# EAGLE design Flashing-light-v5 (EAGLE 7.6.0)
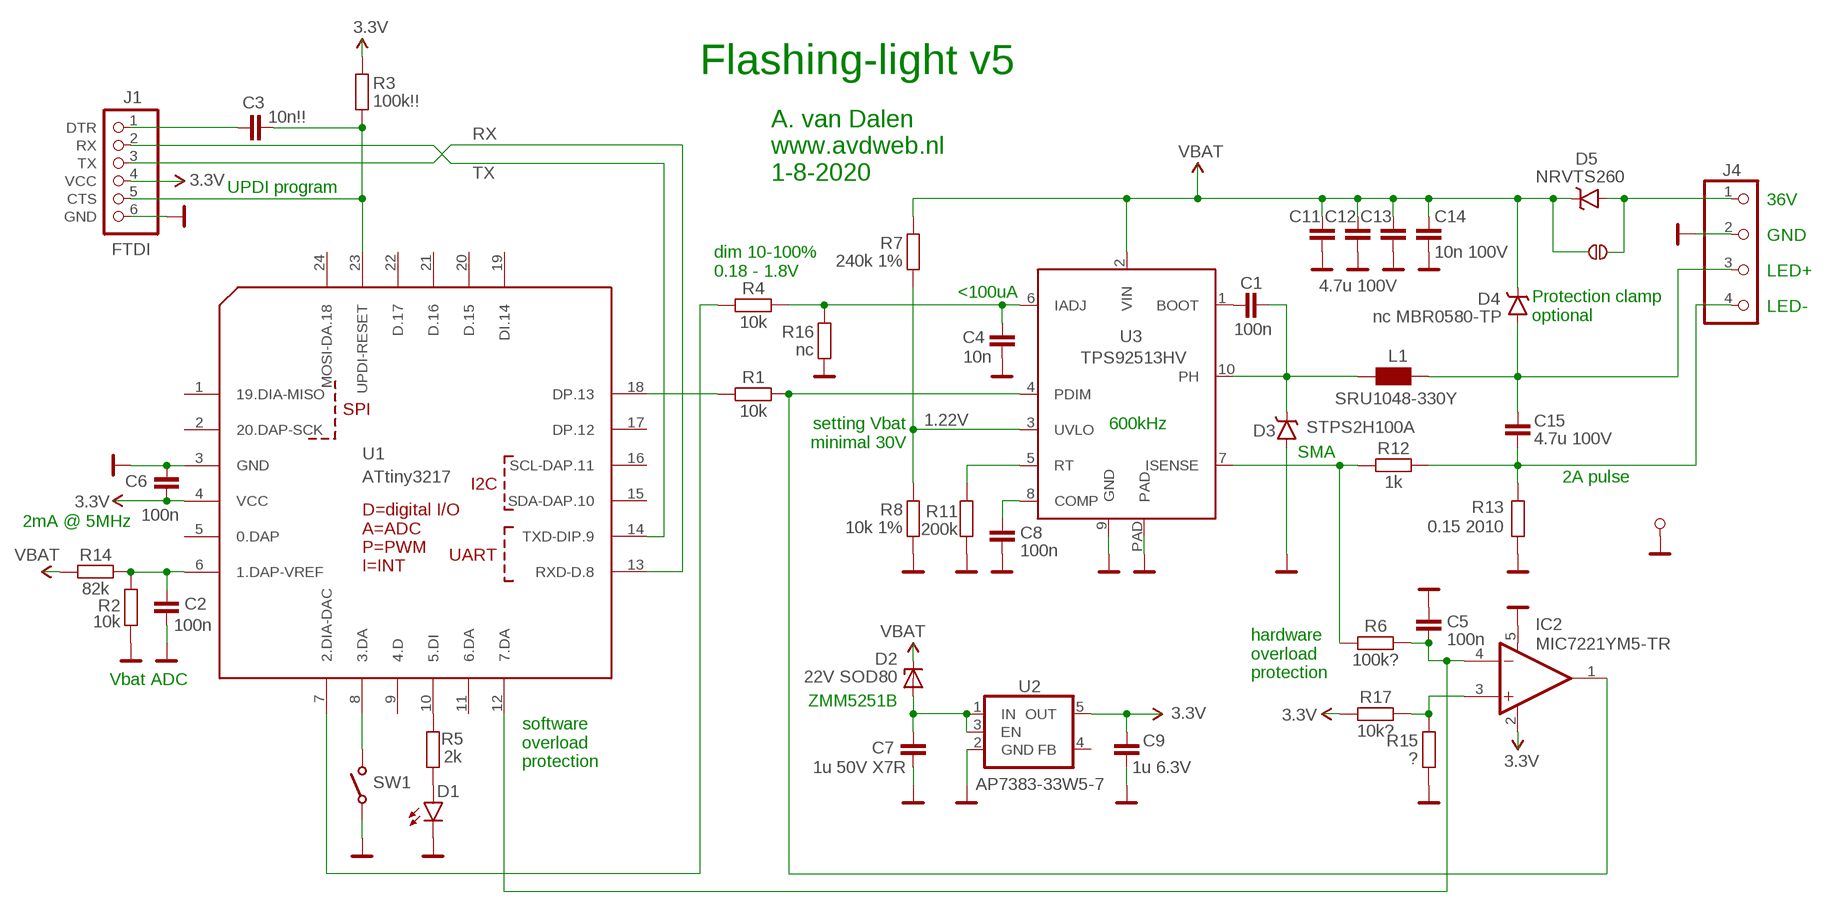
[diagram p0: schematic, sheet 1]
V1 (ARROW): VALUE: x
V2 (ARROW): VALUE: x
V3 (ARROW): VALUE: x
V4 (ARROW): VALUE: x
V5 (ARROW): VALUE: x
V6 (ARROW): VALUE: x
V7 (ARROW): VALUE: x
V8 (ARROW): VALUE: x
V9 (ARROW): VALUE: x

## Parts
C1  100n  SMD-C-0805  [0805-CAP]
C2  100n  SMD-C-0603-SMALL  [0603-SMALL]
C3  10n!!  SMD-C-0603-SMALL  [0603-SMALL]
C4  10n  SMD-C-0603-SMALL  [0603-SMALL]
C5  100n  SMD-C-0603-SMALL  [0603-SMALL]
C6  100n  SMD-C-0603-SMALL  [0603-SMALL]
C7  1u 50V X7R  SMD-C-0805  [0805-CAP]
C8  100n  SMD-C-0603-SMALL  [0603-SMALL]
C9  1u 6.3V  SMD-C-0603-SMALL  [0603-SMALL]
C11  4.7u 100V  SMD-C1210  [1210]
C12  4.7u 100V  SMD-C1210  [1210]
C13  4.7u 100V  SMD-C1210  [1210]
C14  10n 100V  SMD-C-0603-SMALL  [0603-SMALL]
C15  4.7u 100V  SMD-C1210  [1210]
D1  green  LED  [LED-0603]
D2  22V SOD80  ZENER-DIODESOD80C  [SOD80C]
D3  STPS2H100A  SCHOTTKY-SMD-SMA  [SMA]
D4  nc MBR0580-TP  SCHOTTKY-SMDSOD-123  [SOD-123]
D5  NRVTS260  SCHOTTKY-SMDSOD-123  [SOD-123]
IC2  MIC7221YM5-TR  MAX985EUK-T  [SOT23-5L]
J1  FTDI  [ZIGZAG-FTDI]
J3  TP  PIN1.2MM  [PIN-1.2MM]
J4  CON-4PHEADER  [1X04]
JP1  nc  JUMPER_SJ_NONO  [JUMPER_NO]
L1  SRU1048-330Y  INDUCTOR-SMD10X10  [IND-10X10]
R1  10k  SMD-R-0603-SMALL  [0603-SMALL]
R2  10k  SMD-R-0603-SMALL  [0603-SMALL]
R3  100k!!  SMD-R-0603-SMALL  [0603-SMALL]
R4  10k  SMD-R-0603-SMALL  [0603-SMALL]
R5  2k  SMD-R-0603-SMALL  [0603-SMALL]
R6  100k?  SMD-R-0603-SMALL  [0603-SMALL]
R7  240k 1%  SMD-R-0603-SMALL  [0603-SMALL]
R8  10k 1%  SMD-R-0603-SMALL  [0603-SMALL]
R11  200k  SMD-R-0603-SMALL  [0603-SMALL]
R12  1k  SMD-R-0603-SMALL  [0603-SMALL]
R13  0.15 2010  SMD-R2010  [R2010]
R14  82k  SMD-R-0603-SMALL  [0603-SMALL]
R15  ?  SMD-R-0603-SMALL  [0603-SMALL]
R16  nc  SMD-R-0603-SMALL  [0603-SMALL]
R17  10k?  SMD-R-0603-SMALL  [0603-SMALL]
SW1  TACTILE  [TACTILE-PTH]
U1  ATtiny3217  ATTINY3217-  [QFN-24]
U2  AP7383-33W5-7  REG-SOT23-5-OUT5  [SOT23-5]
U3  TPS92513HV  TPS92513  [HVSS0P-10]

## Nets
0.5V: R11.2 U3.5(RT)
1.22V: R7.1 R8.2 U3.3(UVLO)
3.3V: C6.2 C9.1 IC2.2(V+) J1.4(VCC) R3.2 R17.1 U1.4(VCC) U2.5(OUT)
ADC: C2.1 R2.2 R14.1 U1.6(1.DAP-VREF)
GND: C2.2 C4.2 C5.1 C6.1 C7.2 C8.2 C9.2 C11.2 C12.2 C13.2 C14.2 D1.C D3.A IC2.5(V-) J1.6(GND) J3.1 J4.2 R2.1 R8.1 R11.1 R13.1 R15.1 R16.1 SW1.3(P) SW1.4(P) U1.3(GND) U2.2(GND) U3.9(GND) U3.PAD ; supply symbol labelled GND2
N$1: R6.1 R12.1 U3.7(ISENSE)
N$2: C15.2 J4.4 R12.2 R13.2
N$3: D5.A J4.1 JP1.2 JP1.2B
N$4: C1.1 U3.1(BOOT)
N$5: R4.1 U1.7(2.DIA-DAC)
N$6: C15.1 D4.A J4.3 L1.2
N$7: C8.1 U3.8(COMP)
N$8: C7.1 D2.A U2.1(IN) U2.3(EN)
N$9: SW1.1(O) SW1.2(O) U1.8(3.DA)
N$10: R5.2 U1.10(5.DI)
N$11: C5.2 IC2.4(-IN) R6.2 U1.12(7.DA)
N$12: D1.A R5.1
N$15: C4.1 R4.2 R16.2 U3.6(IADJ)
N$19: IC2.1(OUT) R1.2 U3.4(PDIM)
N$20: IC2.3(+IN) R15.2 R17.2
N$21: R1.1 U1.18(DP.13)
N$32: C3.1 J1.1(DTR)
PH: C1.2 D3.C L1.1 U3.10(PH)
RESET: C3.2 J1.5(CTS) R3.1 U1.23(UPDI-RESET)
RX: J1.3(TX) U1.13(RXD-D.8)
TX: J1.2(RX) U1.14(TXD-DIP.9)
VBAT: C11.1 C12.1 C13.1 C14.1 D2.C D4.C D5.C JP1.1 JP1.1A R7.2 R14.2 U3.2(VIN)
Unconnected: U1.1(19.DIA-MISO) U1.2(20.DAP-SCK) U1.5(0.DAP) U1.9(4.D) U1.11(6.DA) U1.15(SDA-DAP.10) U1.16(SCL-DAP.11) U1.17(DP.12) U1.19(DI.14) U1.20(D.15) U1.21(D.16) U1.22(D.17) U1.24(MOSI-DA.18) U2.4(FB)

## Notes on the sheet
- Flashing-light v5
- A. van Dalen
  www.avdweb.nl
  1-8-2020
- UPDI program
- 36V
- GND
- dim 10-100%
  0.18 - 1.8V
- LED+
- <100uA
- LED-
- Protection clamp
  optional
- setting Vbat
  minimal 30V
- 600kHz
- SMA
- 2A pulse
- 2mA @ 5MHz
- hardware
  overload
  protection
- Vbat ADC
- ZMM5251B
- software
  overload
  protection

## Library data of the parts
C1-C9 C11-C15 = Albert:SMD-C: Capacitors ...4.7uF @ 6.3V -> 0402 ...10uF @ 16V -> 0603 ...22uF @ 25V -> 0805
D1 = Albert:LED
D2 = diode:ZENER-DIODE: Z-Diode
D3-D5 = Albert:SCHOTTKY-SMD
IC2 = maxim:MAX98*: Micropower, Low-Voltage Rail-to-Rail I/O Comparators Source: http://pdfserv.maxim-ic.com/en/ds/MAX985-MAX994.pdf; MF: MAXIM; MPN: MAX985EUK-T; OC_FARNELL: unknown; OC_NEWARK: 79C3408
J1 = Albert:FTDI
J3 = Albert:PIN: PIN HEADER
J4 = Albert:CON-4P
JP1 = Albert:JUMPER_SJ_NO: SMD solder JUMPER
L1 = Albert:INDUCTOR-SMD
R1-R8 R11-R17 = Albert:SMD-R: Resistors all kinds in 0603 and 0402
SW1 = Albert:TACTILE
U1 = Albert-Arduino:ATTINY3217: MICROCONTROLLER 4 Kbytes FLASH 128 bytes SRAM 256 bytes EEPROM UART 6-channel 10 bit ADC
U2 = Albert:REG-SOT23-5: Voltage Regulator LDO Standard 150mA LDO voltage regulator in SOT-23 layout. Micrel part MIC5205. BP (by-pass) pin is used to lower output noise with 470pF cap.
U3 = Albert:TPS92513: The LM25011 constant on-time step-down switching regulator features all the functions needed to implement a low-cost, efficient, buck bias regulator capable of supplying up to 2 A of load current. This high-voltage regulator contains an N-Channel Buck switch, a startup regulator, current limit detection, and internal ripple control.; PROD_ID: IC-12528

## Module M1
Ports: 

### Library data of the parts

## Net classes
2 GND: width 0.406 mm

## Board
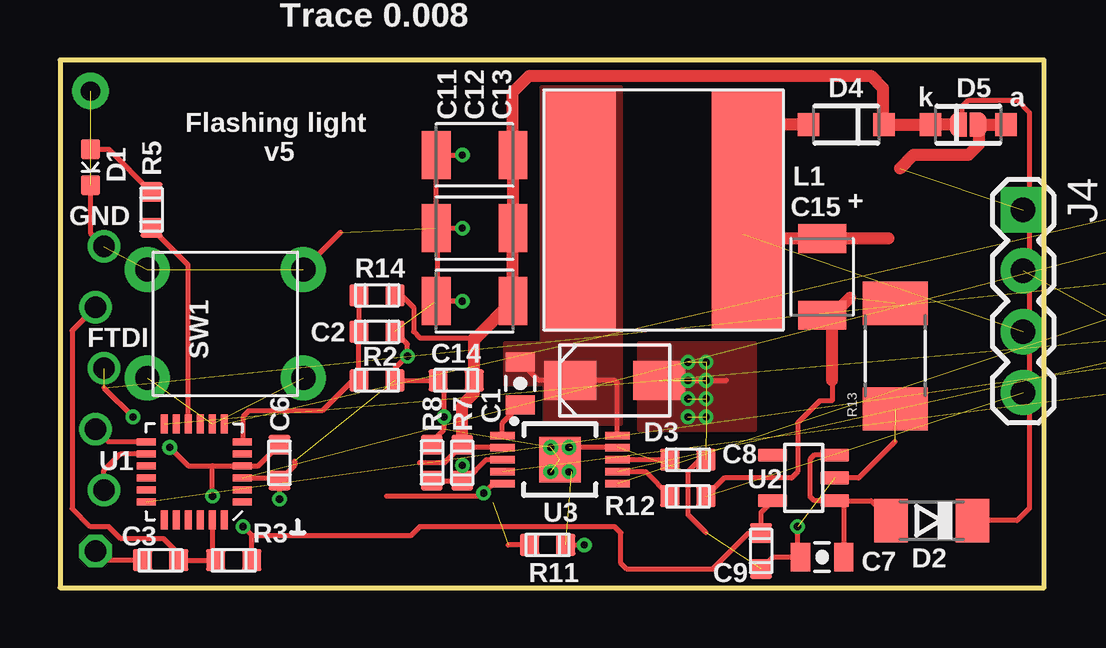
[diagram p1: board, top side]
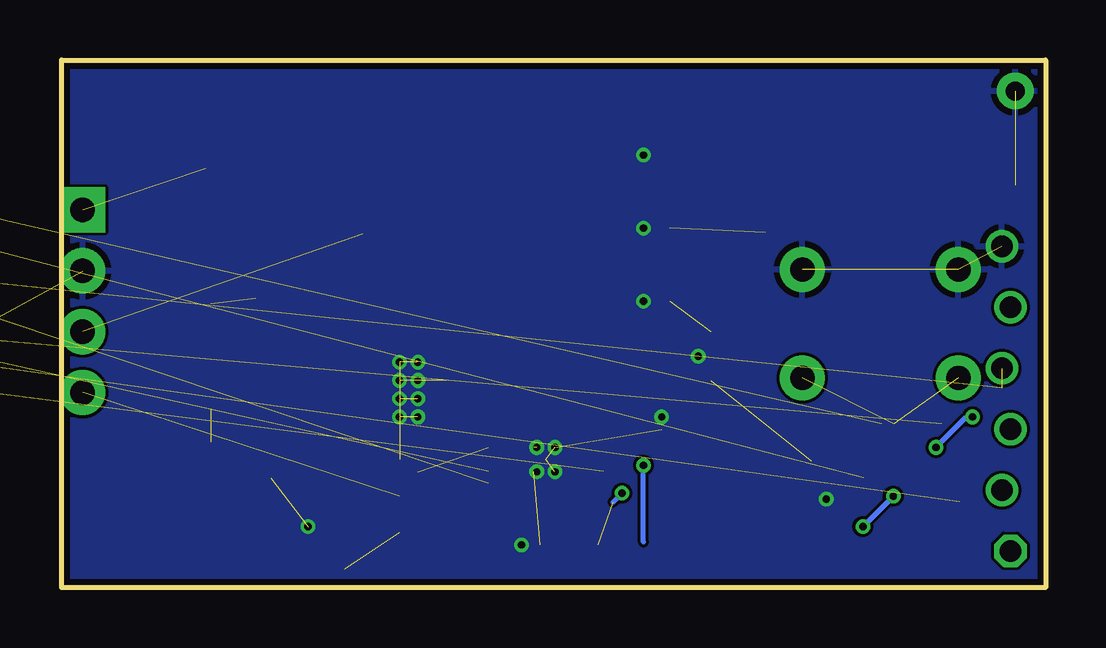
[diagram p2: board, bottom side, seen from below]

Size 41 x 22 mm. Coordinates in mm from the lower left corner, seen from the top.
Outline: 0,0 41,0 41,22 0,22 0,0
Copper layers (1*16): Top 0.035mm / dielectric 1.5mm / Bottom 0.035mm
Design rules "Albert 5mil": minimum track width 5mil, minimum drill 0.3mm, track to track 5mil, track to pad 5mil, pad to pad 5mil, via to via 5mil, smd to smd 5mil, copper to edge 10mil, drill to drill 8mil, minimum pad ring 8.5mil, minimum via ring 6mil, stop-mask expansion 4mil, vias tented up to drill 25mil, thermal gap 10mil

### Footprints (pad centres in the part's own frame; a part is rotated, then mirrored left to right if it is on the bottom)
0805-CAP = smd 0.8 x 1.2: 1 -0.9,0; 2 0.9,0
0603-SMALL = smd 0.9 x 0.8: 1 0,0.75; 2 0,-0.75
1210 = smd 1.2 x 2: 1 -1.6,0; 2 1.6,0
LED-0603 = smd 0.8 x 0.8: A 0,-0.75; C 0,0.75
SOD80C = smd 1.4 x 1.8: A 1.7,0; C -1.7,0
SMA = smd 2.184 x 1.626: A 1.854,0; C -1.854,0
SOD-123 = smd 0.9 x 0.95: A 1.575,0; C -1.575,0
SOT23-5L = smd 0.55 x 1.2: 1 -0.95,-1.3; 2 0,-1.3; 3 0.95,-1.3; 4 0.95,1.3; 5 -0.95,1.3
ZIGZAG-FTDI = drill 0.9 octagon: 1 0,0.177 | drill 0.9: 2 2.54,-0.177; 3 5.08,0.177; 4 7.62,-0.177; 5 10.16,0.177; 6 12.7,-0.177
PIN-1.2MM = drill 0.8 pad 1.524: 1 0,0
1X04 = drill 1.016 pad 1.88 square: 1 0,0 | drill 1.016 pad 1.88: 2 2.54,0; 3 5.08,0; 4 7.62,0
JUMPER_NO = smd 0.635 x 1.016: 1 -0.445,0; 2 0.445,0 | smd 0.381 x 1.016: 1A -0.254,0; 2B 0.254,0
IND-10X10 = smd 3 x 10: 1 -3.5,0; 2 3.5,0
R2010 = smd 1.8 x 2.7: 1 -2.2,0; 2 2.2,0
TACTILE-PTH = drill 1.016 pad 1.88: 1 -3.251,2.261; 2 3.251,2.261; 3 -3.251,-2.261; 4 3.251,-2.261
QFN-24 = smd 0.8 x 0.3: 1 -2,1.25; 2 -2,0.75; 3 -2,0.25; 4 -2,-0.25; 5 -2,-0.75; 6 -2,-1.25; 13 2,-1.25; 14 2,-0.75; 15 2,-0.25; 16 2,0.25; 17 2,0.75; 18 2,1.25 | smd 0.3 x 0.8: 7 -1.25,-2; 8 -0.75,-2; 9 -0.25,-2; 10 0.25,-2; 11 0.75,-2; 12 1.25,-2; 19 1.25,2; 20 0.75,2; 21 0.25,2; 22 -0.25,2; 23 -0.75,2; 24 -1.25,2
SOT23-5 = smd 0.55 x 1.2: 1 -0.95,-1.3; 2 0,-1.3; 3 0.95,-1.3; 4 0.95,1.3; 5 -0.95,1.3
HVSS0P-10 = smd 0.3 x 1.02: 1 -1,-2.4; 2 -0.5,-2.4; 3 0,-2.4; 4 0.5,-2.4; 5 1,-2.4; 6 1,2.4; 7 0.5,2.4; 8 0,2.4; 9 -0.5,2.4; 10 -1,2.4 | smd 1.905 x 1.727: PAD 0,0

### Placement (x,y rotation side)
C1  19.18,8.51 90 top
C2  13.21,10.67 90 top
C3  4.19,1.14 90 top
C4  57.91,17.53 0 top  (outside the outline)
C5  68.07,13.21 0 top  (outside the outline)
C6  9.14,5.21 180 top
C7  31.75,1.27 180 top
C8  26.16,5.33 90 top
C9  29.21,1.52 0 top
C11  17.27,11.94 180 top
C12  17.27,14.99 180 top
C13  17.27,18.03 180 top
C14  16.51,8.64 270 top
C15  31.75,12.95 270 top
D1  1.27,17.53 180 top
D2  36.32,2.79 180 top
D3  23.11,8.64 0 top
D4  32.77,19.3 180 top
D5  37.85,19.3 0 top
IC2  53.09,5.33 0 top  (outside the outline)
J1  1.65,1.52 90 top
J3  1.27,20.7 0 top
J4  40.13,15.75 270 top
JP1  37.85,19.3 0 top
L1  25.15,15.75 0 top
R1  77.72,13.21 0 top  (outside the outline)
R2  13.21,8.64 270 top
R3  7.24,1.14 90 top
R4  55.12,17.27 0 top  (outside the outline)
R5  3.81,15.75 0 top
R6  64.01,13.21 0 top  (outside the outline)
R7  16.76,5.21 180 top
R8  15.49,5.21 0 top
R11  20.32,1.78 270 top
R12  26.16,3.81 90 top
R13  34.8,9.65 90 top
R14  13.21,12.19 90 top
R15  59.94,13.21 0 top  (outside the outline)
R16  60.96,17.78 0 top  (outside the outline)
R17  55.88,13.21 0 top  (outside the outline)
SW1  6.89,11 180 top
U1  5.59,4.83 180 top
U2  30.99,4.57 90 top
U3  20.83,5.33 270 top

### Tracks (layer width: path | path; a pad name or v marks a point on that pad's centre or on a via)
0.5V  (via drill 0.3)  (1 unrouted)
  Top 0.203: R11.2 18.67,1.78 | U3.5 18.05,4.33 v17.65,3.94 17.53,3.81 13.6,3.81
  Bottom 0.203: 18.03,3.56 v17.65,3.94
1.22V  (via drill 0.3)
  Top 0.203: R7.1 16.9,4.46 17.78,5.33 U3.3 | v16.76,5.09 R7.1 | R8.2 R7.1
  Bottom 0.203: 16.76,1.91 v16.76,5.09
3.3V  (via drill 0.3)  (3 unrouted)
  Top 0.203: U2.5 29.21,3.14 C9.1 28.69,2.27 27.18,0.76 23.62,0.76 23.37,1.02 23.37,2.29 23.11,2.54 14.99,2.54 14.61,2.16 8.1,2.16 7.99,2.17 | v4.57,5.84 5.34,5.08 6.35,5.08 | C6.2 8.26,5.08 U1.4 6.35,5.08 | R3.2 7.99,2.17 | 7.99,2.17 v7.62,2.54 | v6.35,3.81 6.35,5.08 | 1.83,8.33 v3.05,7.11
  Bottom 0.203: v4.57,5.84 3.3,7.11 v3.05,7.11 | v7.62,2.54 v6.35,3.81
ADC
  Top 0.203: R14.1 C2.1 R2.2 12.19,8.64 10.92,7.37 7.87,7.37 7.62,7.11 7.62,6.11 U1.6
GND  (via drill 0.3)  (30 unrouted)
  Top 0.203: U3.9 21.33,5.83 U3.PAD 21.32,4.84 21.31,4.83 v21.21,4.83 | C9.2 29.71,1.27 C7.2 30.73,1.27 v30.73,2.54 | C8.2 26.67,5.33 26.16,4.83 26.16,3.05 26.91,2.3 | U1.3 9.03,4.58 C6.1 | R11.1 v21.84,1.78 | C6.1 v9.14,3.68 | C2.2 14.48,10.15 v14.48,9.65 13.96,9.13 R2.1 C14.2 16,8.39 v16,7.11 16,6.6 15.36,5.96 R8.1 | C11.2 v16.76,11.94 16,11.94 15.75,12.19 15.75,14.91 C12.2 | C12.2 v16.76,14.99 | v16.76,18.03 C13.2 C12.2 | v26.16,8.64 27.77,8.64 | U2.2 33.27,4.57 33.78,5.08 34.78,6.08 | D1.C 1.27,14.78 J1.6 | 9.78,5.28 9.78,5.21 9.78,5.08 9.77,5.08 C6.1 | 11.68,14.8 SW1.3
  other vias: 26.16,9.4 26.92,9.4 26.92,8.64 26.92,7.87 26.92,7.11 26.16,7.11 20.45,5.84 21.21,5.84 20.45,4.83 26.16,7.87
  pour Top (no thermals): 28.96,10.16 24.13,10.16 24.13,6.6 28.96,6.6
  pour Bottom: 0.25,21.84 40.89,21.84 40.89,0.25 0.25,0.25
N$1  (1 unrouted)
  Top 0.203: U3.7 24.39,4.83 R12.1
N$2  (2 unrouted)
  Top 0.203: 32.17,8.64 32.17,7.79 31.66,7.79 30.73,6.86 30.73,4.83 30.48,4.57 27.67,4.57 R12.2 | C15.2 32.17,10.93 32.51,11.27 32.51,11.68
  Top 0.508: 32.17,8.64 32.17,10.93 | 32.91,12.08 32.51,11.68
N$3  (1 unrouted)
  Top 0.203: JP1.2 JP1.2B
  Top 0.508: D5.A JP1.2 38.29,18.48 37.85,18.03 35.56,18.03 35,17.47
N$4
  Top 0.203: 18.94,7.61 C1.1 18.43,6.86 U3.1
N$5  (1 unrouted)
N$6  (1 unrouted)
  Top 0.203: 28.63,14.55 28.45,14.73 28.45,15.55 L1.2 28.7,15.8 28.7,19.05 28.96,19.3
  Top 0.508: 28.63,14.55 C15.1 34.53,14.55 | D4.A 28.96,19.3
N$7
  Top 0.203: U3.8 C8.1
N$8
  Top 0.203: 32.51,1.41 C7.1 32.65,3.62 U2.1 | U2.1 31.43,3.62 31.24,3.81 31.24,5.33 31.43,5.52 U2.3 | U2.1 33.79,3.62 D2.A
N$9  (2 unrouted)
N$10
  Top 0.203: R5.2 3.81,14.99 5.08,13.72 5.34,13.46 U1.10
N$11  (3 unrouted)
N$12
  Top 0.203: D1.A 2.03,18.28 R5.1
N$15  (3 unrouted)
N$19  (2 unrouted)
N$20  (2 unrouted)
N$21  (1 unrouted)
N$32
  Top 0.203: C3.1 1.85,1.14 J1.1
PH
  Top 0.203: C1.2 19.95,8.64 D3.C 23.11,8.64 23.23,8.52 U3.10
  pour Top (no thermals): 20.07,20.83 20.07,10.16 18.54,10.16 18.54,8.51 20.19,8.51 20.19,6.86 23.37,6.86 23.37,20.83
RESET
  Top 0.203: U1.23 6.34,1.29 R3.1 C3.2 4.94,1.41 4.32,2.03 2.54,2.03 2.03,2.54 1.27,2.54 0.51,3.3 0.51,10.72 J1.5
RX
  Top 0.203: U1.13 2,6.08 J1.3
TX
  Top 0.203: J1.2 1.83,4.88 2.54,5.59 3.58,5.59 U1.14
VBAT
  Top 0.203: U3.2 16.76,5.83 R7.2 16.01,5.21 14.97,5.21 | C14.1 17.26,8.12 | R14.2 14.22,12.19 14.73,11.68 14.73,10.67 14.99,10.41 17.27,10.41 | 17.27,10.41 17.35,10.41 | 17.26,10.4 17.27,10.41 | 37.59,2.87 D2.C 39.88,2.79 40.39,3.3 40.39,19.81 39.88,20.32 37.85,20.32 37.59,20.07 JP1.1A JP1.1 | 34.29,19.36 D4.C
  Top 0.508: R7.2 16.76,7.62 17.26,8.12 | 17.35,10.41 C11.1 C12.1 C13.1 18.87,20.65 19.56,21.34 33.78,21.34 34.29,20.83 34.29,19.36 | C14.1 17.26,10.4 | D4.C D5.C JP1.1

### Text on the board
tPlace: Polygon width 0.008 / Trace 0.008
tNames: k | a | Flashing light / v5 | + | GND | FTDI
bNames: 36V | SWITCH | LED+ | LED- | DIG | GND